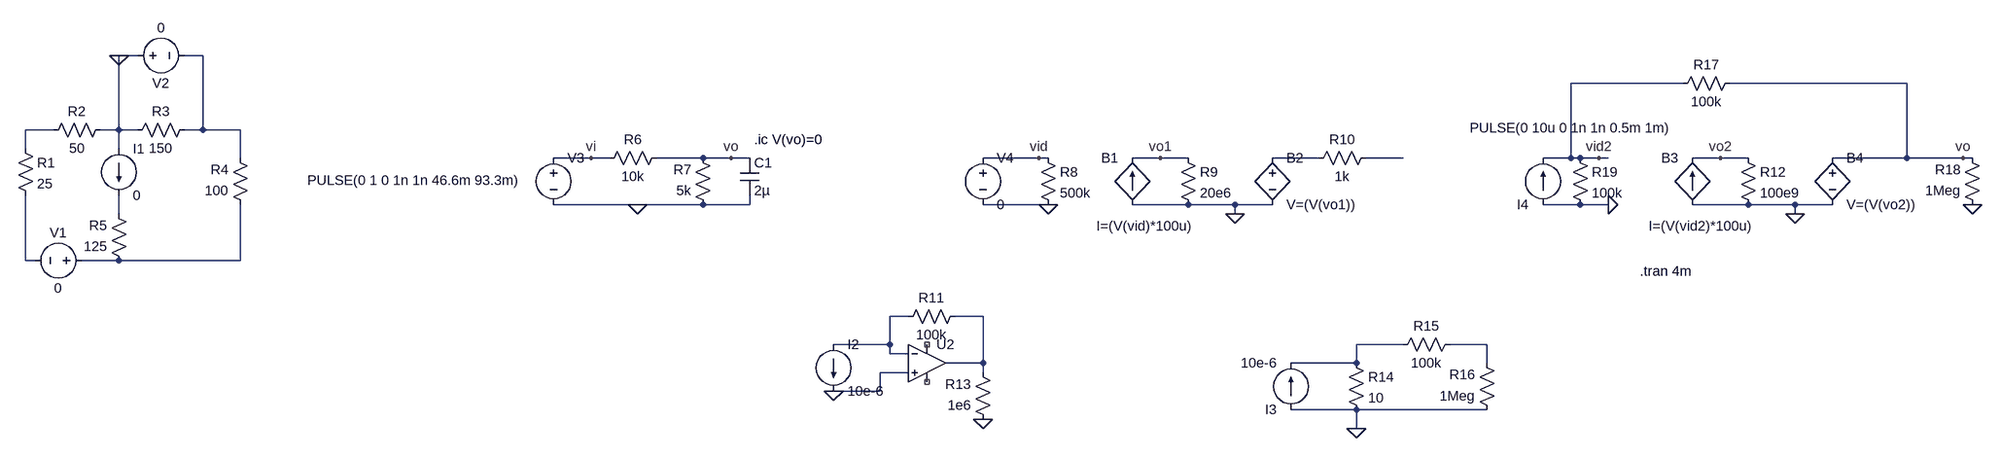
[diagram p0: schematic Draft2.asc]
Draft2.asc, the LTspice schematic file:
Version 4
SHEET 1 3668 680
WIRE 304 -16 272 -16
WIRE 416 -16 384 -16
WIRE 3008 32 2816 32
WIRE 3392 32 3088 32
WIRE 160 112 112 112
WIRE 272 112 272 -16
WIRE 272 112 240 112
WIRE 304 112 272 112
WIRE 416 112 416 -16
WIRE 416 112 384 112
WIRE 480 112 416 112
WIRE 112 144 112 112
WIRE 272 144 272 112
WIRE 480 160 480 112
WIRE 1136 160 1072 160
WIRE 1168 160 1136 160
WIRE 1328 160 1248 160
WIRE 1376 160 1328 160
WIRE 1408 160 1376 160
WIRE 1904 160 1808 160
WIRE 1920 160 1904 160
WIRE 2112 160 2064 160
WIRE 2160 160 2112 160
WIRE 2384 160 2304 160
WIRE 2528 160 2464 160
WIRE 2816 160 2816 32
WIRE 2816 160 2768 160
WIRE 2832 160 2816 160
WIRE 2864 160 2832 160
WIRE 2880 160 2864 160
WIRE 3072 160 3024 160
WIRE 3120 160 3072 160
WIRE 3392 160 3392 32
WIRE 3392 160 3264 160
WIRE 3488 160 3392 160
WIRE 3504 160 3488 160
WIRE 1216 240 1072 240
WIRE 1328 240 1216 240
WIRE 1408 240 1408 224
WIRE 1408 240 1328 240
WIRE 1920 240 1808 240
WIRE 2160 240 2064 240
WIRE 2240 240 2160 240
WIRE 2304 240 2240 240
WIRE 2832 240 2768 240
WIRE 2880 240 2832 240
WIRE 3120 240 3024 240
WIRE 3200 240 3120 240
WIRE 3264 240 3200 240
WIRE 272 256 272 224
WIRE 2240 256 2240 240
WIRE 3200 256 3200 240
WIRE 112 336 112 224
WIRE 128 336 112 336
WIRE 272 336 208 336
WIRE 480 336 480 240
WIRE 480 336 272 336
WIRE 1680 432 1648 432
WIRE 1808 432 1760 432
WIRE 1648 480 1648 432
WIRE 1648 480 1552 480
WIRE 2528 480 2448 480
WIRE 2672 480 2608 480
WIRE 1648 496 1648 480
WIRE 1680 496 1648 496
WIRE 1808 512 1808 432
WIRE 1808 512 1744 512
WIRE 2448 512 2448 480
WIRE 2448 512 2336 512
WIRE 2672 512 2672 480
WIRE 1680 528 1632 528
WIRE 1808 528 1808 512
WIRE 1632 560 1632 528
WIRE 1632 560 1552 560
WIRE 2448 592 2336 592
WIRE 2672 592 2448 592
WIRE 2448 624 2448 592
FLAG 272 -16 0
FLAG 1216 240 0
FLAG 1136 160 vi
FLAG 1376 160 vo
FLAG 2240 256 0
FLAG 1920 240 0
FLAG 1904 160 vid
FLAG 2112 160 vo1
FLAG 3200 256 0
FLAG 2880 240 0
FLAG 2864 160 vid2
FLAG 3072 160 vo2
FLAG 1808 608 0
FLAG 1552 560 0
FLAG 2448 624 0
FLAG 3504 240 0
FLAG 3488 160 vo
SYMBOL res 96 128 R0
SYMATTR InstName R1
SYMATTR Value 25
SYMBOL res 256 96 R90
WINDOW 0 0 56 VBottom 2
WINDOW 3 32 56 VTop 2
SYMATTR InstName R2
SYMATTR Value 50
SYMBOL res 400 96 R90
WINDOW 0 0 56 VBottom 2
WINDOW 3 32 56 VTop 2
SYMATTR InstName R3
SYMATTR Value 150
SYMBOL res 496 256 R180
WINDOW 0 36 76 Left 2
WINDOW 3 36 40 Left 2
SYMATTR InstName R4
SYMATTR Value 100
SYMBOL res 288 352 R180
WINDOW 0 36 76 Left 2
WINDOW 3 36 40 Left 2
SYMATTR InstName R5
SYMATTR Value 125
SYMBOL voltage 224 336 R90
WINDOW 0 -32 56 VBottom 2
WINDOW 3 32 56 VTop 2
WINDOW 123 0 0 Left 0
WINDOW 39 0 0 Left 0
SYMATTR InstName V1
SYMATTR Value 0
SYMBOL current 272 144 R0
WINDOW 123 0 0 Left 0
WINDOW 39 0 0 Left 0
SYMATTR InstName I1
SYMATTR Value 0
SYMBOL voltage 288 -16 R270
WINDOW 0 -32 56 VBottom 2
WINDOW 3 32 56 VTop 2
WINDOW 123 0 0 Left 0
WINDOW 39 0 0 Left 0
SYMATTR InstName V2
SYMATTR Value 0
SYMBOL voltage 1072 144 R0
WINDOW 3 -422 54 Left 2
WINDOW 123 0 0 Left 0
WINDOW 39 0 0 Left 0
SYMATTR InstName V3
SYMATTR Value PULSE(0 1 0 1n 1n 46.6m 93.3m)
SYMBOL res 1264 144 R90
WINDOW 0 0 56 VBottom 2
WINDOW 3 32 56 VTop 2
SYMATTR InstName R6
SYMATTR Value 10k
SYMBOL res 1344 256 R180
WINDOW 0 36 76 Left 2
WINDOW 3 36 40 Left 2
SYMATTR InstName R7
SYMATTR Value 5k
SYMBOL cap 1392 160 R0
SYMATTR InstName C1
SYMATTR Value 2µ
SYMBOL res 1904 144 R0
SYMATTR InstName R8
SYMATTR Value 500k
SYMBOL voltage 1808 144 R0
WINDOW 123 0 0 Left 0
WINDOW 39 0 0 Left 0
SYMATTR InstName V4
SYMATTR Value 0
SYMBOL res 2144 144 R0
SYMATTR InstName R9
SYMATTR Value 20e6
SYMBOL res 2480 144 R90
WINDOW 0 0 56 VBottom 2
WINDOW 3 32 56 VTop 2
SYMATTR InstName R10
SYMATTR Value 1k
SYMBOL bi 2064 240 R180
WINDOW 0 24 80 Left 2
WINDOW 3 -102 -37 Left 2
SYMATTR InstName B1
SYMATTR Value I=(V(vid)*100u)
SYMBOL bv 2304 144 R0
SYMATTR InstName B2
SYMATTR Value V=(V(vo1))
SYMBOL res 3104 144 R0
SYMATTR InstName R12
SYMATTR Value 100e9
SYMBOL bi 3024 240 R180
WINDOW 0 24 80 Left 2
WINDOW 3 -102 -37 Left 2
SYMATTR InstName B3
SYMATTR Value I=(V(vid2)*100u)
SYMBOL bv 3264 144 R0
SYMATTR InstName B4
SYMATTR Value V=(V(vo2))
SYMBOL current 1552 480 R0
WINDOW 123 0 0 Left 0
WINDOW 39 0 0 Left 0
SYMATTR InstName I2
SYMATTR Value 10e-6
SYMBOL res 1776 416 R90
WINDOW 0 0 56 VBottom 2
WINDOW 3 32 56 VTop 2
SYMATTR InstName R11
SYMATTR Value 100k
SYMBOL res 1824 624 R180
WINDOW 0 36 76 Left 2
WINDOW 3 36 40 Left 2
SYMATTR InstName R13
SYMATTR Value 1e6
SYMBOL Opamps\\UniversalOpAmp 1712 512 R0
SYMATTR InstName U2
SYMBOL res 2432 496 R0
SYMATTR InstName R14
SYMATTR Value 10
SYMBOL current 2336 592 R180
WINDOW 123 0 0 Left 0
WINDOW 39 0 0 Left 0
SYMATTR InstName I3
SYMATTR Value 10e-6
SYMBOL res 2624 464 R90
WINDOW 0 0 56 VBottom 2
WINDOW 3 32 56 VTop 2
SYMATTR InstName R15
SYMATTR Value 100k
SYMBOL res 2688 608 R180
WINDOW 0 36 76 Left 2
WINDOW 3 36 40 Left 2
SYMATTR InstName R16
SYMATTR Value 1Meg
SYMBOL current 2768 240 R180
WINDOW 3 -219 132 Left 2
WINDOW 123 0 0 Left 0
WINDOW 39 0 0 Left 0
SYMATTR InstName I4
SYMATTR Value PULSE(0 10u 0 1n 1n 0.5m 1m)
SYMBOL res 3104 16 R90
WINDOW 0 0 56 VBottom 2
WINDOW 3 32 56 VTop 2
SYMATTR InstName R17
SYMATTR Value 100k
SYMBOL res 3520 256 R180
WINDOW 0 36 76 Left 2
WINDOW 3 36 40 Left 2
SYMATTR InstName R18
SYMATTR Value 1Meg
SYMBOL res 2816 144 R0
SYMATTR InstName R19
SYMATTR Value 100k
TEXT 2934 354 Left 2 !.tran 4m
TEXT 1416 128 Left 2 !.ic V(vo)=0

The netlist it stands for:
* Draft2.asc
R1 N002 N006 25
R2 0 N002 50
R3 N001 0 150
R4 N007 N001 100
R5 N007 N005 125
V1 N007 N006 0
I1 0 N005 0
V2 0 N001 0
V3 vi 0 PULSE(0 1 0 1n 1n 46.6m 93.3m)
R6 vo vi 10k
R7 0 vo 5k
C1 vo 0 2µ
R8 vid 0 500k
V4 vid 0 0
R9 vo1 0 20e6
R10 N004 N003 1k
B1 0 vo1 I=(V(vid)*100u)
B2 N003 0 V=(V(vo1))
R12 vo2 0 100e9
B3 0 vo2 I=(V(vid2)*100u)
B4 vo 0 V=(V(vo2))
I2 N008 0 10e-6
R11 N009 N008 100k
R13 0 N009 1e6
XU2 0 N008 NC_01 NC_02 N009 level1 Avol=1Meg GBW=10Meg Vos=0 En=0 Enk=0 In=0 Ink=0 Rin=500Meg  ; pins In+ In- V+ V- OUT
R14 N010 0 10
I3 0 N010 10e-6
R15 N011 N010 100k
R16 0 N011 1Meg
I4 0 vid2 PULSE(0 10u 0 1n 1n 0.5m 1m)
R17 vo vid2 100k
R18 0 vo 1Meg
R19 vid2 0 100k
.tran 4m
.ic V(vo)=0
.lib UniversalOpAmp1.lib
.backanno
.end